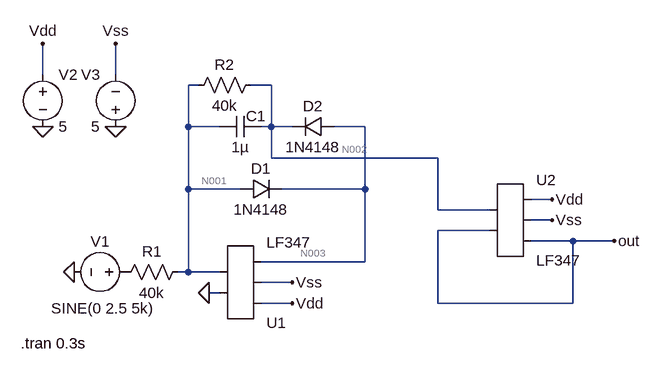
[diagram p0: schematic q2.asc]
q2.asc, the LTspice schematic file:
Version 4
SHEET 1 880 680
WIRE -224 -1024 -224 -1072
WIRE -112 -1024 -112 -1072
WIRE 16 -1008 0 -1008
WIRE 128 -1008 96 -1008
WIRE 0 -944 0 -1008
WIRE 48 -944 0 -944
WIRE 128 -944 128 -1008
WIRE 128 -944 112 -944
WIRE 160 -944 128 -944
WIRE 272 -944 224 -944
WIRE 128 -896 128 -944
WIRE 384 -896 128 -896
WIRE 0 -848 0 -944
WIRE 80 -848 0 -848
WIRE 272 -848 272 -944
WIRE 272 -848 144 -848
WIRE 560 -832 528 -832
WIRE 384 -816 384 -896
WIRE 464 -816 384 -816
WIRE 560 -800 528 -800
WIRE 464 -784 384 -784
WIRE 592 -768 528 -768
WIRE 656 -768 592 -768
WIRE 272 -736 272 -848
WIRE 272 -736 112 -736
WIRE 0 -720 0 -848
WIRE 0 -720 -16 -720
WIRE 48 -720 0 -720
WIRE 160 -704 112 -704
WIRE 48 -688 32 -688
WIRE 160 -672 112 -672
WIRE 384 -672 384 -784
WIRE 592 -672 592 -768
WIRE 592 -672 384 -672
FLAG -224 -944 0
FLAG -112 -944 0
FLAG 32 -688 0
FLAG -176 -720 0
FLAG -224 -1072 Vdd
FLAG 160 -672 Vdd
FLAG 560 -832 Vdd
FLAG -112 -1072 Vss
FLAG 160 -704 Vss
FLAG 560 -800 Vss
FLAG 656 -768 out
SYMBOL AutoGenerated\\LF347 80 -704 M180
SYMATTR InstName U1
SYMBOL AutoGenerated\\LF347 496 -800 R0
SYMATTR InstName U2
SYMBOL voltage -80 -720 R90
WINDOW 0 -32 56 VBottom 2
WINDOW 3 40 52 VTop 2
WINDOW 123 0 0 Left 0
WINDOW 39 0 0 Left 0
SYMATTR InstName V1
SYMATTR Value SINE(0 2.5 5k)
SYMBOL voltage -224 -1040 R0
WINDOW 123 0 0 Left 0
WINDOW 39 0 0 Left 0
SYMATTR InstName V2
SYMATTR Value 5
SYMBOL voltage -112 -928 R180
WINDOW 0 24 96 Left 2
WINDOW 3 24 16 Left 2
WINDOW 123 0 0 Left 0
WINDOW 39 0 0 Left 0
SYMATTR InstName V3
SYMATTR Value 5
SYMBOL res 0 -736 R90
WINDOW 0 0 56 VBottom 2
WINDOW 3 32 56 VTop 2
SYMATTR InstName R1
SYMATTR Value 40k
SYMBOL res 112 -1024 R90
WINDOW 0 0 56 VBottom 2
WINDOW 3 32 56 VTop 2
SYMATTR InstName R2
SYMATTR Value 40k
SYMBOL cap 112 -960 R90
WINDOW 0 15 8 VBottom 2
WINDOW 3 32 32 VTop 2
SYMATTR InstName C1
SYMATTR Value 1µ
SYMBOL diode 80 -832 R270
WINDOW 0 32 32 VTop 2
WINDOW 3 0 32 VBottom 2
SYMATTR InstName D1
SYMATTR Value 1N4148
SYMBOL diode 224 -960 R90
WINDOW 0 0 32 VBottom 2
WINDOW 3 32 32 VTop 2
SYMATTR InstName D2
SYMATTR Value 1N4148
TEXT -258 -610 Left 2 !.tran 0.3s

The netlist it stands for:
* q2.asc
* U1: LF347 (symbol AutoGenerated\LF347 not available, pins judged from their places): pin1=0 pin2=N001 pin3=Vdd pin4=Vss pin5=N003
* U2: LF347 (symbol AutoGenerated\LF347 not available, pins judged from their places): pin1=N002 pin2=out pin3=Vdd pin4=Vss pin5=out
V1 P001 0 SINE(0 2.5 5k)
V2 Vdd 0 5
V3 0 Vss 5
R1 N001 P001 40k
R2 N002 N001 40k
C1 N002 N001 1µ
D1 N001 N003 1N4148
D2 N003 N002 1N4148
.model D D
.lib standard.dio
.tran 0.3s
.backanno
.end

* Results of the author's LTspice run, read from the files saved beside the schematic
* Operating Point, zero values left out:
*   V(n003) = 1.408 mV
*   V(vss) = -5 V
*   V(vdd) = 5 V
*   V(n001) = 1.852 µV
*   V(out) = 4.69 µV
*   V(n002) = 2.825 µV
*   I(D2) = 79.34 pA
*   I(D1) = -76.97 pA
*   I(R2) = 24.33 pA
*   I(R1) = 46.29 pA
*   I(V3) = -1.724 mA
*   I(V2) = -1.723 mA
*   I(V1) = 46.29 pA
*   Ix(u1:1) = 55.01 pA
*   Ix(u1:2) = 55.01 pA
*   Ix(u1:3) = 861.7 µA
*   Ix(u1:4) = -862 µA
*   Ix(u1:5) = -156.3 pA
*   Ix(u2:1) = 55.01 pA
*   Ix(u2:2) = 55.01 pA
*   Ix(u2:3) = 861.7 µA
*   Ix(u2:4) = -862 µA
*   Ix(u2:5) = -55.01 pA